# EAGLE schematic roboproj q3 (EAGLE 9.6.2)
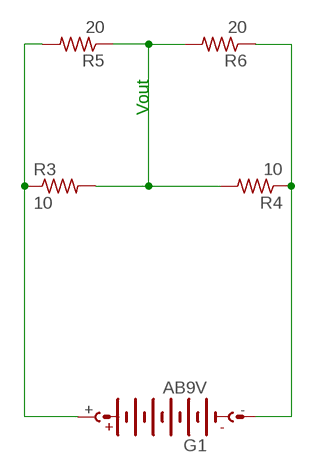
[diagram p0: schematic, sheet 1]

## Parts
G1  AB9V  [AB9V]
R3  10  R-US_R0805  [R0805]
R4  10  R-US_R0805  [R0805]
R5  20  R-US_R0805  [R0805]
R6  20  R-US_R0805  [R0805]

## Nets
N$4: G1.+ R3.1 R5.2
N$5: R3.2 R4.2 R5.1 R6.2
N$6: G1.- R4.1 R6.1

## Notes on the sheet
- Vout

## Library data of the parts
G1 = battery:AB9V: 9-V BATTERY CLIP
R3-R6 = rcl:R-US_: RESISTOR, American symbol; SPICEPREFIX: R